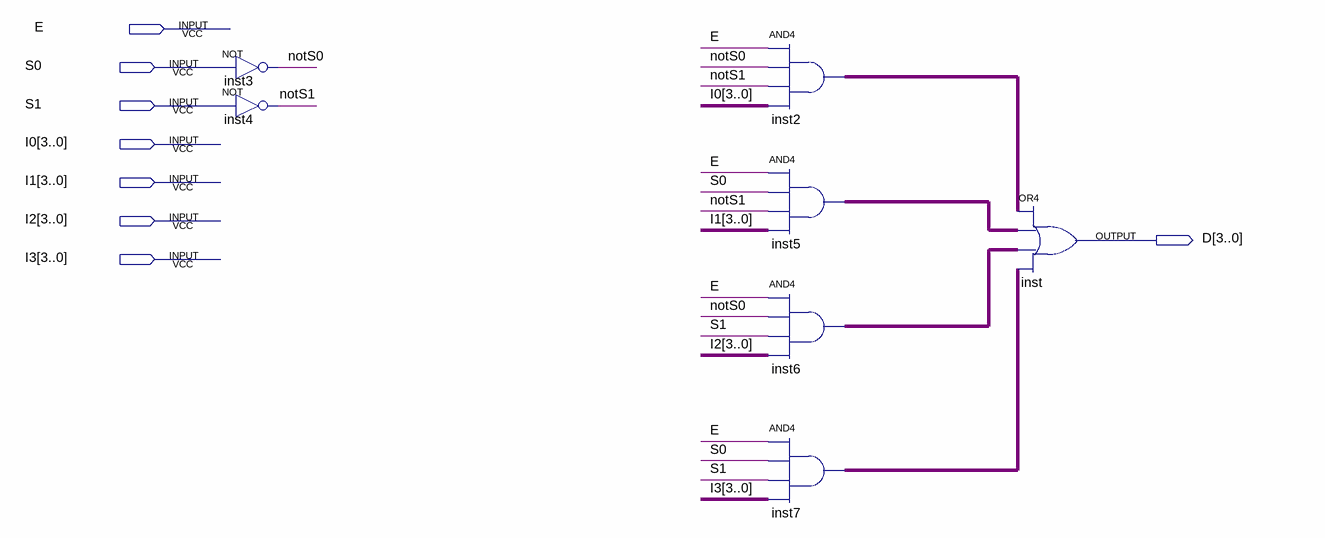
[diagram p0: schematic sheet]
// Quartus schematic mp4_1_4.bdf as structural Verilog: 7 symbols, 8 pins
module mp4_1_4 (
  input  E,
  input  S0,
  input  S1,
  input  [3:0] I0,
  input  [3:0] I1,
  input  [3:0] I2,
  input  [3:0] I3,
  output [3:0] D
);

  wire notS0, notS1;
  wire [3:0] inst2_out, inst5_out, inst6_out, inst7_out;

  not inst3 (notS0, S0);
  not inst4 (notS1, S1);
  assign inst2_out = {4{E}} & {4{notS0}} & {4{notS1}} & I0;  // AND4 inst2, 4 bits wide
  assign inst5_out = {4{E}} & {4{S0}} & {4{notS1}} & I1;  // AND4 inst5, 4 bits wide
  assign inst6_out = {4{E}} & {4{notS0}} & {4{S1}} & I2;  // AND4 inst6, 4 bits wide
  assign inst7_out = {4{E}} & {4{S0}} & {4{S1}} & I3;  // AND4 inst7, 4 bits wide
  assign D = inst2_out | inst5_out | inst6_out | inst7_out;  // OR4 inst, 4 bits wide
endmodule
